# Altium project CenterBoard_Mega16.PrjPcb
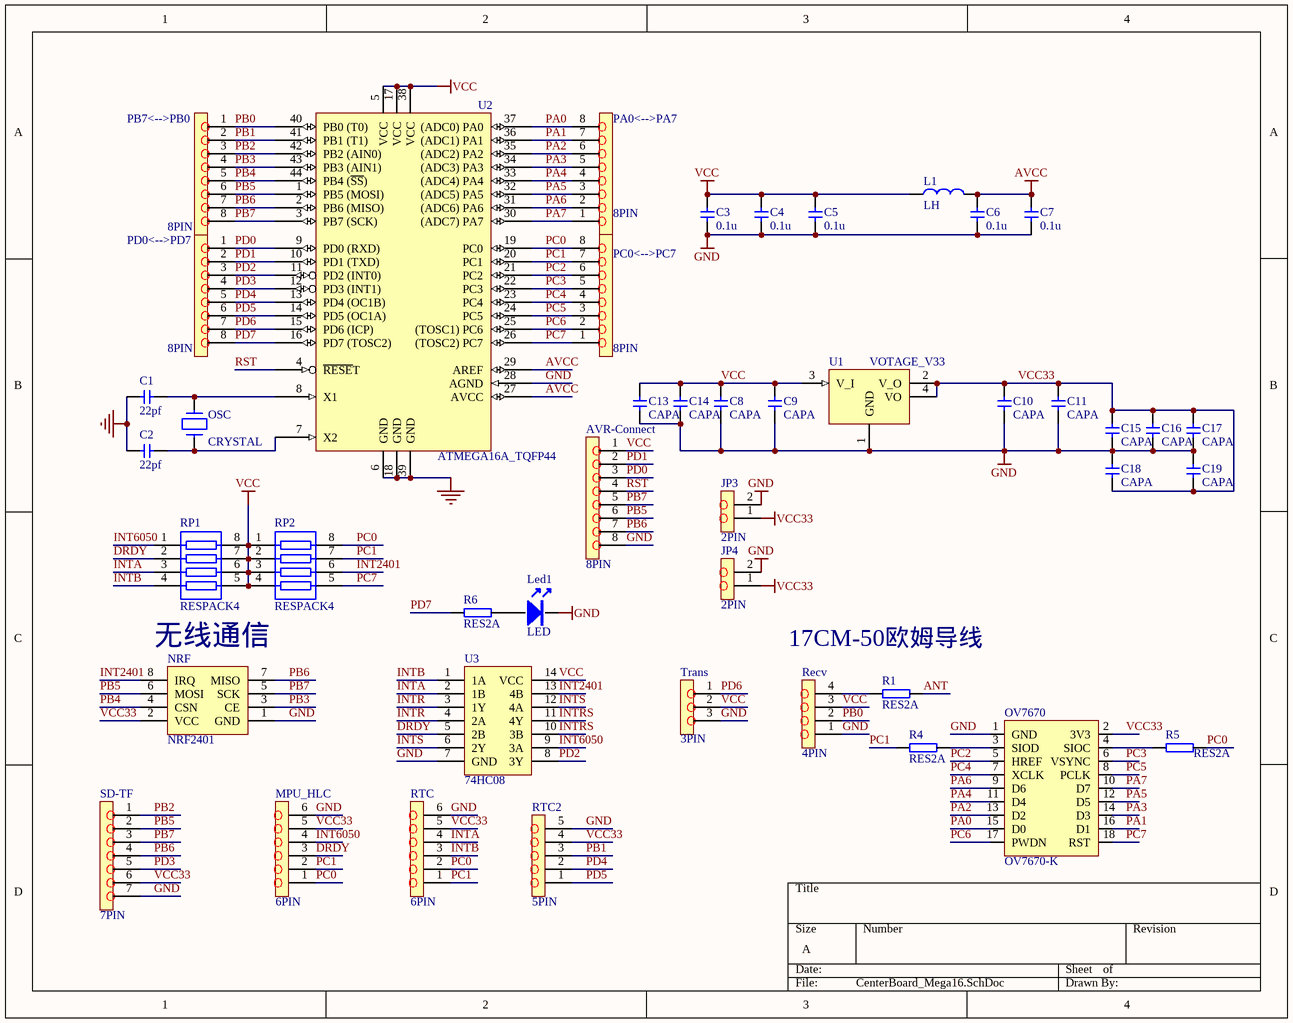
[diagram p0: CenterBoard_Mega16.SchDoc]
1 sheet, 45 parts. Net scope: global (net labels, ports and power ports of the same name join across sheets).
Board file: CenterBoard_Mega16.PcbDoc

## Sheet CenterBoard_Mega16.SchDoc
size A

### Parts
AVR-Connect  8PIN  [SIP8]
C1  22pf  [RC100]
C2  22pf  [RC100]
C3  0.1u  [RC100]
C4  0.1u  [RC100]
C5  0.1u  [RC100]
C6  0.1u  [RC100]
C7  0.1u  [RC100]
C8  CAPA  [RC100]
C9  CAPA  [RC100]
C10  CAPA  [RC100]
C11  CAPA  [RC100]
C13  CAPA  [RC100]
C14  CAPA  [RC100]
C15  CAPA  [RC100]
C16  CAPA  [RC100]
C17  CAPA  [RC100]
C18  CAPA  [RC100]
C19  CAPA  [RC100]
JP3  2PIN  [SIP2]
JP4  2PIN  [SIP2]
L1  LH  [1206]
Led1  LED  [LED]
MPU_HLC  6PIN  [SIP6]
NRF  NRF2401  [NRF2401]
OSC  CRYSTAL  [OSC200]
OV7670  OV7670-K  [SIP9X2]
PA0<-->PA7  8PIN  [SIP8]
PB7<-->PB0  8PIN  [SIP8]
PC0<-->PC7  8PIN  [SIP8]
PD0<-->PD7  8PIN  [SIP8]
R1  RES2A  [0805]
R4  RES2A  [0805]
R5  RES2A  [0805]
R6  RES2A  [0805]
Recv  4PIN  [SIP4]
RP1  RESPACK4  [RN4]
RP2  RESPACK4  [RN4]
RTC  6PIN  [SIP6]
RTC2  5PIN  [SIP5]
SD-TF  7PIN  [SIP7]
Trans  3PIN  [SIP3]
U1  VOTAGE_V33  [SOT-223]
U2  ATMEGA16A_TQFP44  [TQFP-44]
U3  74HC08  [SO-14]

### Nets
AVCC: C6.1 C7.1 L1.2 U2.27(AVCC) U2.29(AREF)
GND: AVR-Connect.8 C1.1 C2.1 C3.2 C4.2 C5.2 C6.2 C7.2 C8.2 C9.2 C10.2 C11.2 C13.2 C14.2 C15.2 C16.2 C17.2 C18.1 C19.1 JP3.2 JP4.2 Led1.K MPU_HLC.6 NRF.1(GND) OV7670.1(GND) Recv.1 RTC.6 RTC2.5 SD-TF.7 Trans.3 U1.1(GND) U2.6(GND) U2.18(GND) U2.28(AGND) U2.39(GND) U3.7(GND)
VCC: AVR-Connect.1 C3.1 C4.1 C5.1 C8.1 C9.1 C13.1 C14.1 L1.1 Recv.3 RP1.5 RP1.6 RP1.7 RP1.8 RP2.1 RP2.2 RP2.3 RP2.4 Trans.2 U1.3(V_I) U2.5(VCC) U2.17(VCC) U2.38(VCC) U3.14(VCC)
VCC33: C10.1 C11.1 C15.1 C16.1 C17.1 C18.2 C19.2 JP3.1 JP4.1 MPU_HLC.5 NRF.2(VCC) OV7670.2(3V3) RTC.5 RTC2.4 SD-TF.6 U1.2(V_O) U1.4(VO)
ANT: R1.2
DRDY: MPU_HLC.3 RP1.2 U3.5(2B)
INT2401: NRF.8(IRQ) RP2.6 U3.13(4B)
INT6050: MPU_HLC.4 RP1.1 U3.9(3A)
INTA: RP1.3 RTC.4 U3.2(1B)
INTB: RP1.4 RTC.3 U3.1(1A)
INTR: U3.3(1Y) U3.4(2A)
INTRS: U3.10(3B) U3.11(4Y)
INTS: U3.6(2Y) U3.12(4A)
PA0: OV7670.15(D0) PA0<-->PA7.8 U2.37((ADC0)_PA0)
PA1: OV7670.16(D1) PA0<-->PA7.7 U2.36((ADC1)_PA1)
PA2: OV7670.13(D2) PA0<-->PA7.6 U2.35((ADC2)_PA2)
PA3: OV7670.14(D3) PA0<-->PA7.5 U2.34((ADC3)_PA3)
PA4: OV7670.11(D4) PA0<-->PA7.4 U2.33((ADC4)_PA4)
PA5: OV7670.12(D5) PA0<-->PA7.3 U2.32((ADC5)_PA5)
PA6: OV7670.9(D6) PA0<-->PA7.2 U2.31((ADC6)_PA6)
PA7: OV7670.10(D7) PA0<-->PA7.1 U2.30((ADC7)_PA7)
PB0: PB7<-->PB0.1 Recv.2 U2.40(PB0_(T0))
PB1: PB7<-->PB0.2 RTC2.3 U2.41(PB1_(T1))
PB2: PB7<-->PB0.3 SD-TF.1 U2.42(PB2_(AIN0))
PB3: NRF.3(CE) PB7<-->PB0.4 U2.43(PB3_(AIN1))
PB4: NRF.4(CSN) PB7<-->PB0.5 U2.44(PB4_(~{SS}))
PB5: AVR-Connect.6 NRF.6(MOSI) PB7<-->PB0.6 SD-TF.2 U2.1(PB5_(MOSI))
PB6: AVR-Connect.7 NRF.7(MISO) PB7<-->PB0.7 SD-TF.4 U2.2(PB6_(MISO))
PB7: AVR-Connect.5 NRF.5(SCK) PB7<-->PB0.8 SD-TF.3 U2.3(PB7_(SCK))
PC0: MPU_HLC.1 PC0<-->PC7.8 R5.2 RP2.8 RTC.2 U2.19(PC0)
PC1: MPU_HLC.2 PC0<-->PC7.7 R4.1 RP2.7 RTC.1 U2.20(PC1)
PC2: OV7670.5(HREF) PC0<-->PC7.6 U2.21(PC2)
PC3: OV7670.6(VSYNC) PC0<-->PC7.5 U2.22(PC3)
PC4: OV7670.7(XCLK) PC0<-->PC7.4 U2.23(PC4)
PC5: OV7670.8(PCLK) PC0<-->PC7.3 U2.24(PC5)
PC6: OV7670.17(PWDN) PC0<-->PC7.2 U2.25((TOSC1)_PC6)
PC7: OV7670.18(RST) PC0<-->PC7.1 RP2.5 U2.26((TOSC2)_PC7)
PD0: AVR-Connect.3 PD0<-->PD7.1 U2.9(PD0_(RXD))
PD1: AVR-Connect.2 PD0<-->PD7.2 U2.10(PD1_(TXD))
PD2: PD0<-->PD7.3 U2.11(PD2_(INT0)) U3.8(3Y)
PD3: PD0<-->PD7.4 SD-TF.5 U2.12(PD3_(INT1))
PD4: PD0<-->PD7.5 RTC2.2 U2.13(PD4_(OC1B))
PD5: PD0<-->PD7.6 RTC2.1 U2.14(PD5_(OC1A))
PD6: PD0<-->PD7.7 Trans.1 U2.15(PD6_(ICP))
PD7: PD0<-->PD7.8 R6.1 U2.16(PD7_(TOSC2))
RST: AVR-Connect.4 U2.4(~{RESE}T)
NetC1_2: C1.2 OSC.2 U2.8(X1)
NetC2_2: C2.2 OSC.1 U2.7(X2)
NetLed1_A: Led1.A R6.2
NetOV7670_3: OV7670.3(SIOD) R4.2
NetOV7670_4: OV7670.4(SIOC) R5.1
NetR1_1: R1.1 Recv.4

### Notes on the sheet
- 无线通信
- 17CM-50欧姆导线

### Library data of the parts
C1-C7 = CAPA
U2 = ATMEGA16A_TQFP44: Atmel Microcontroller - Library created by carel..  <www.mpfreezone.com>